# EAGLE design p2c14_001 (EAGLE 6.5.0)
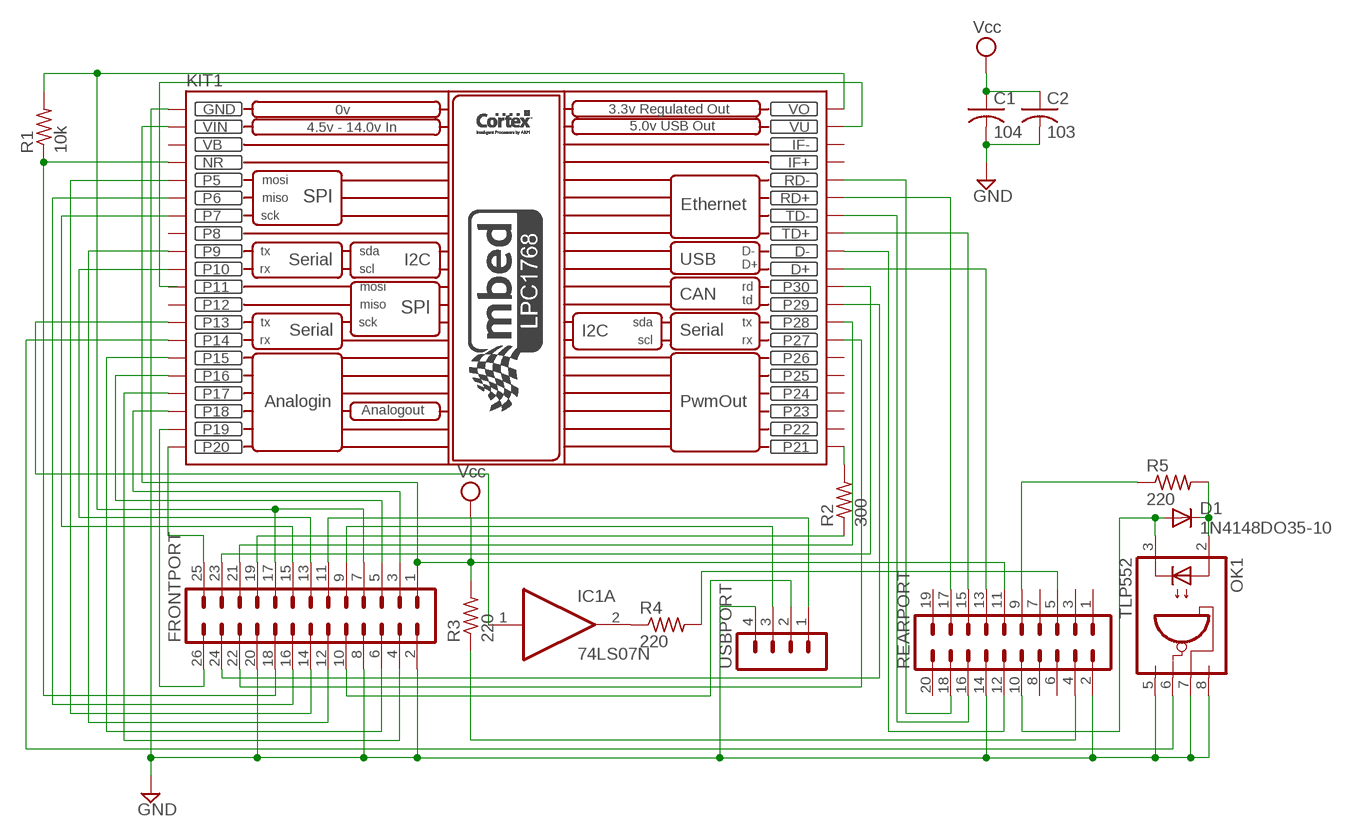
[diagram p0: schematic, sheet 1]

## Parts
C1  104  C-US025-025X050  [C025-025X050]
C2  103  C-US050-075X075  [C050-075X075]
D1  1N4148DO35-10  [DO35-10]
FRONTPORT  ML26L  [ML26L]
IC1  74LS07N  [DIL14]
KIT1  MBED_NXP_LPC1768  [MBED-KIT]
OK1  TLP552  6N137  [DIL08]
R1  10k  R-US_0204/7  [0204/7]
R2  300  R-US_0204/7  [0204/7]
R3  220  R-US_0204/7  [0204/7]
R4  220  R-US_0204/7  [0204/7]
R5  220  R-US_0204/7  [0204/7]
REARPORT  ML20L  [ML20L]
USBPORT  MA04-1  [MA04-1]

## Nets
GND: C1.2 C2.2 FRONTPORT.2 FRONTPORT.8 FRONTPORT.20 KIT1.GND OK1.5(GND) OK1.7(VE) OK1.8(VCC) REARPORT.2 REARPORT.14 USBPORT.4
N$1: R3.1 REARPORT.4
N$2: IC1.2(A:O) R4.1
N$3: D1.C OK1.2(A) R5.2
N$4: R5.1 REARPORT.9
N$5: KIT1.P$14(P14) OK1.6(VO)
N$6: KIT1.D- REARPORT.12
N$7: D1.A OK1.3(C) REARPORT.10
N$8: KIT1.D+ REARPORT.13
N$9: FRONTPORT.18 KIT1.NR R1.1
N$10: FRONTPORT.12 KIT1.P$9(P9)
N$11: FRONTPORT.11 USBPORT.1
N$12: FRONTPORT.3 KIT1.P$18(P18)
N$13: FRONTPORT.4 KIT1.P$17(P17)
N$14: FRONTPORT.5 KIT1.P$16(P16)
N$15: FRONTPORT.6 KIT1.P$15(P15)
N$16: KIT1.P$21(P21) R2.2
N$17: KIT1.TD+ REARPORT.15
N$18: FRONTPORT.13 KIT1.P$10(P10)
N$19: FRONTPORT.14 KIT1.P$5(P5)
N$20: FRONTPORT.15 KIT1.P$7(P7)
N$21: FRONTPORT.16 KIT1.P$6(P6)
N$22: FRONTPORT.19 R2.1
N$23: FRONTPORT.21 KIT1.P$28(P28)
N$24: FRONTPORT.22 KIT1.P$27(P27)
N$26: FRONTPORT.23 KIT1.P$30(P30)
N$27: FRONTPORT.24 KIT1.P$29(P29)
N$28: FRONTPORT.25 KIT1.P$20(P20)
N$29: FRONTPORT.26 KIT1.P$19(P19)
N$30: IC1.1(A:I) KIT1.P$13(P13)
N$31: R4.2 REARPORT.5
N$32: KIT1.TD- REARPORT.16
N$33: KIT1.RD+ REARPORT.17
N$34: KIT1.RD- REARPORT.18
N$35: KIT1.VU
N$36: FRONTPORT.7 FRONTPORT.17 KIT1.VOUT(VO) R1.2
N$39: FRONTPORT.10 USBPORT.2
N$40: FRONTPORT.9 USBPORT.3
VCC: C1.1 C2.1 FRONTPORT.1 KIT1.VIN R3.2 REARPORT.11 ; supply symbol labelled Vcc
Unconnected: IC1.3(B:I) IC1.4(B:O) IC1.5(C:I) IC1.6(C:O) IC1.8(D:O) IC1.9(D:I) IC1.10(E:O) IC1.11(E:I) IC1.12(F:O) IC1.13(F:I) KIT1.IF+ KIT1.IF- KIT1.P$8(P8) KIT1.P$11(P11) KIT1.P$12(P12) KIT1.P$22(P22) KIT1.P$23(P23) KIT1.P$24(P24) KIT1.P$25(P25) KIT1.P$26(P26) REARPORT.1 REARPORT.3 REARPORT.6 REARPORT.7 REARPORT.8 REARPORT.19 REARPORT.20

## Power pins joined to a net without a drawn wire
GND: IC1.7(P:GND)
VB: KIT1.VB
VCC: IC1.14(P:VCC)

## Library data of the parts
C1 C2 = rcl:C-US: CAPACITOR, American symbol
D1 = diode:1N4148: DIODE high speed (Philips)
FRONTPORT = con-ml:ML26L: HARTING; OC_FARNELL: unknown; OC_NEWARK: unknown
IC1 = 74xx-us:74*07: Hex BUFFER, open collector high-voltage output
KIT1 = MBED_v2.1:MBED_NXP_LPC1768: Mbed LPC1768 - ARM CORTEX v2.1 * Schematic symbol is now placed in eagles's default raster. *The pads diameter are suitable for routing between mbed pins * mbed pads are 0.8 mm drill diameter. --------------------------------------------- Created by: Mohamed Yousry *Alexandria, Egypt *Email: mohamed.yousry@ieeegoldegypt.org
OK1 = optocoupler:6N137: MOTOROLA OPTO COUPLER; MPN: 6N137; OC_FARNELL: 1328376; OC_NEWARK: 52M1895
R1-R5 = resistor:R-US_: RESISTOR, American symbol
REARPORT = con-ml:ML20L: HARTING; OC_FARNELL: unknown; OC_NEWARK: unknown
USBPORT = con-lstb:MA04-1: PIN HEADER; OC_FARNELL: unknown; OC_NEWARK: unknown

## Board
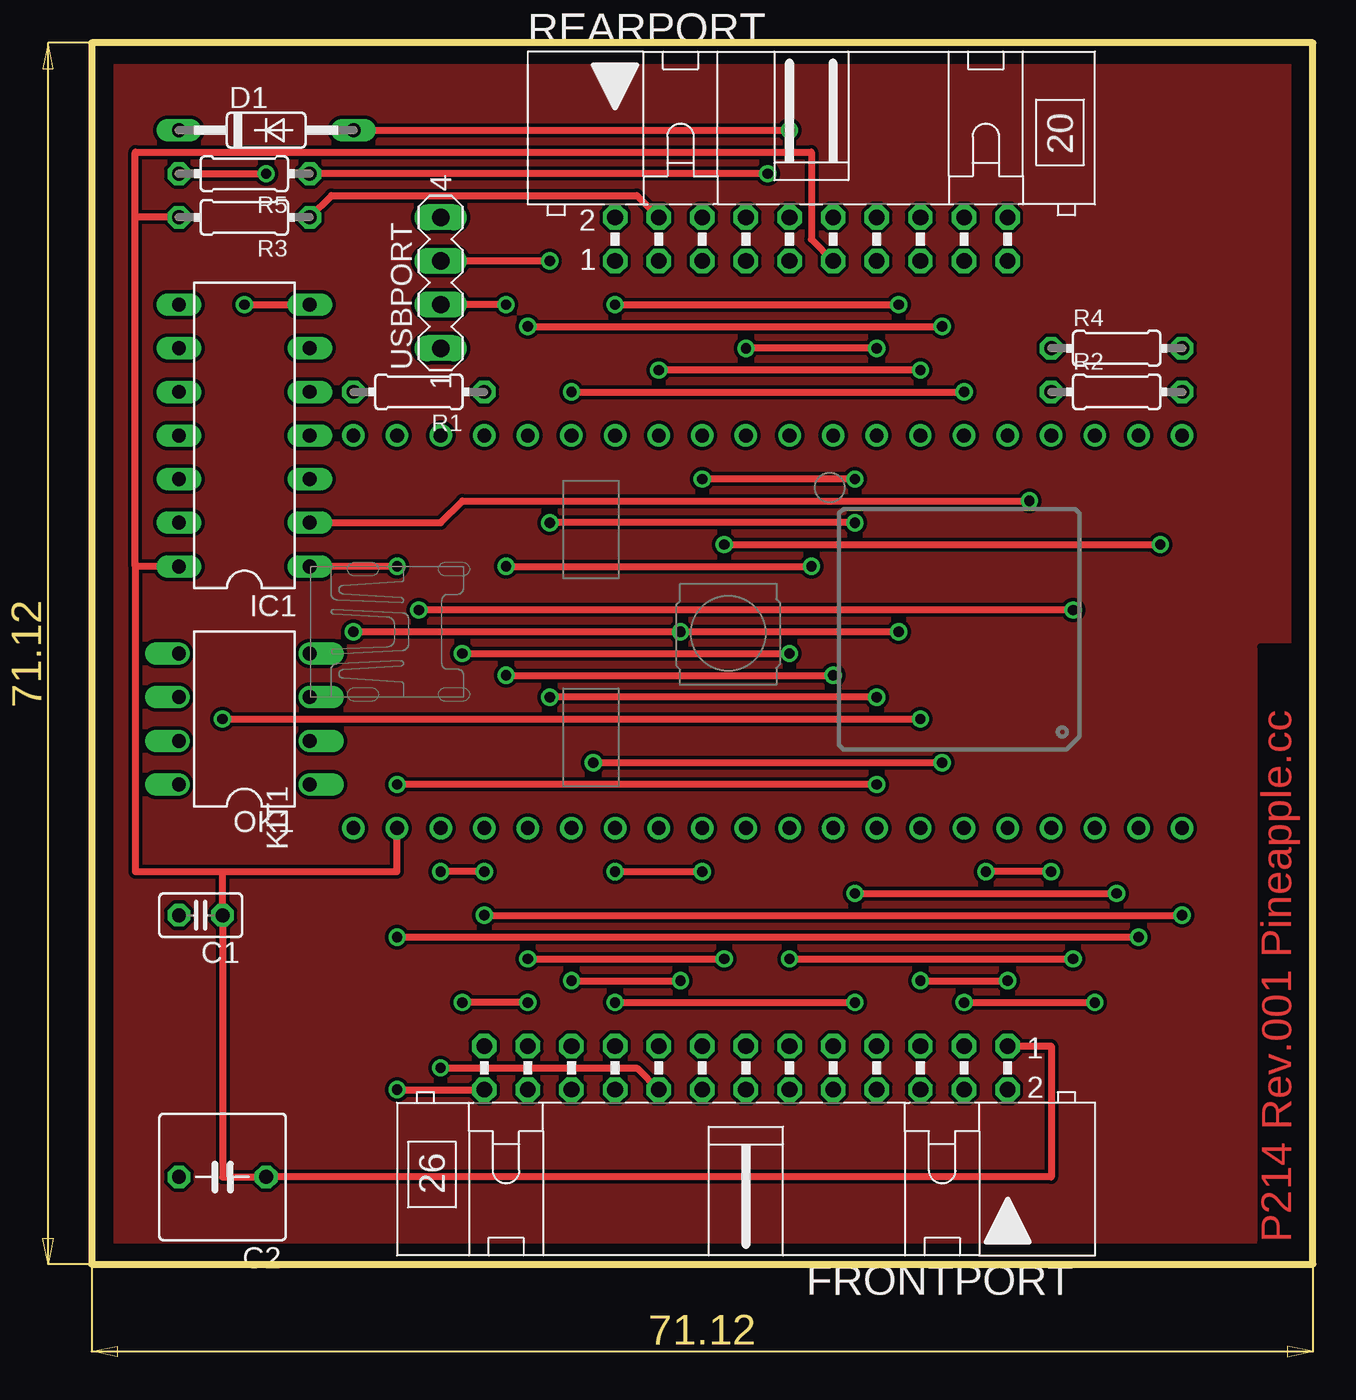
[diagram p1: board, top side]
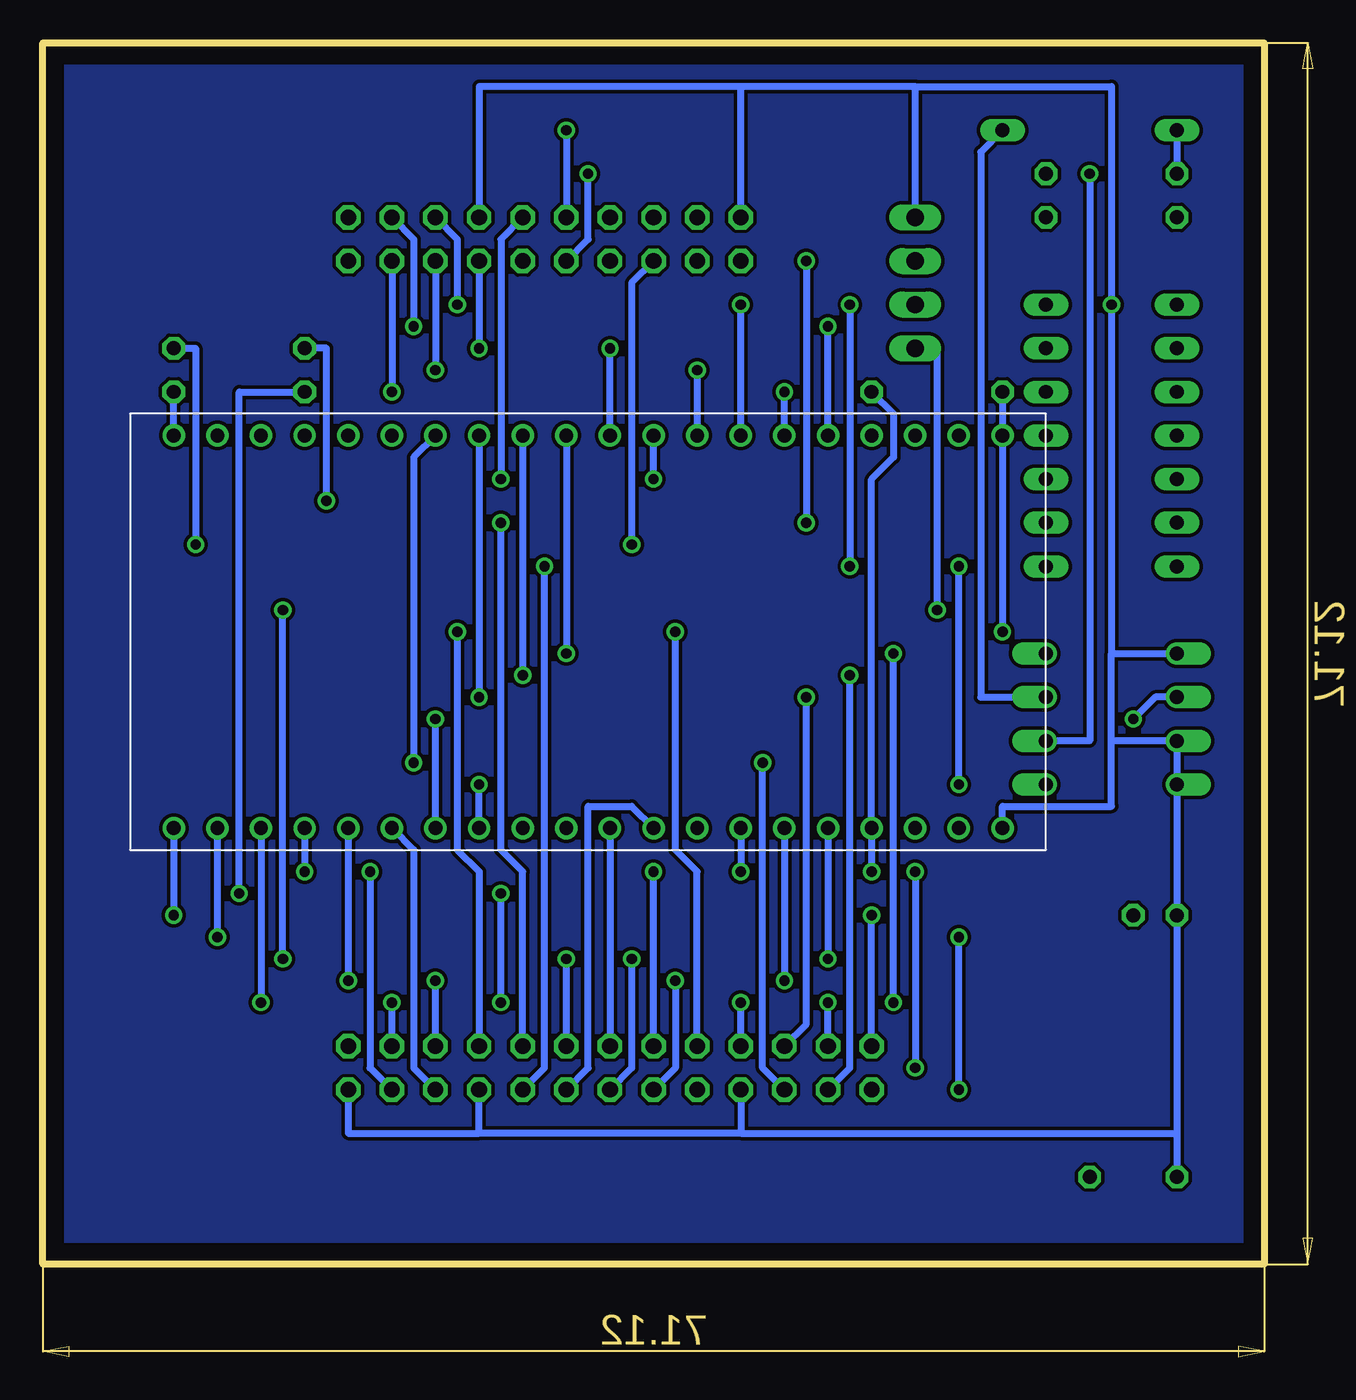
[diagram p2: board, bottom side, seen from below]

Size 71.12 x 71.12 mm. Coordinates in mm from the lower left corner, seen from the top.
Outline: 0,0 71.12,0 71.12,71.12 0,71.12 0,0
Copper layers (1*16): Top 0.035mm / dielectric 1.5mm / Bottom 0.035mm
Design rules "default": minimum track width 10mil, minimum drill 24mil, track to track 8mil, track to pad 8mil, pad to pad 8mil, via to via 8mil, smd to smd 8mil, copper to edge 40mil, drill to drill 8mil, minimum pad ring 10mil, minimum via ring 8mil, stop-mask expansion 4mil, vias tented up to drill 0mil, thermal gap 10mil

### Footprints (pad centres in the part's own frame; a part is rotated, then mirrored left to right if it is on the bottom)
C025-025X050 = drill 0.813 octagon: 1 -1.27,0; 2 1.27,0
C050-075X075 = drill 0.813 octagon: 1 -2.54,0; 2 2.54,0
DO35-10 = drill 0.813 long: A 5.08,0; C -5.08,0
ML26L = drill 0.914 octagon: 1 -15.24,-1.27; 2 -15.24,1.27; 3 -12.7,-1.27; 4 -12.7,1.27; 5 -10.16,-1.27; 6 -10.16,1.27; 7 -7.62,-1.27; 8 -7.62,1.27; 9 -5.08,-1.27; 10 -5.08,1.27; 11 -2.54,-1.27; 12 -2.54,1.27; 13 0,-1.27; 14 0,1.27; 15 2.54,-1.27; 16 2.54,1.27; 17 5.08,-1.27; 18 5.08,1.27; 19 7.62,-1.27; 20 7.62,1.27; 21 10.16,-1.27; 22 10.16,1.27; 23 12.7,-1.27; 24 12.7,1.27; 25 15.24,-1.27; 26 15.24,1.27
DIL14 = drill 0.813 long: 1 -7.62,-3.81; 2 -5.08,-3.81; 3 -2.54,-3.81; 4 0,-3.81; 5 2.54,-3.81; 6 5.08,-3.81; 7 7.62,-3.81; 8 7.62,3.81; 9 5.08,3.81; 10 2.54,3.81; 11 0,3.81; 12 -2.54,3.81; 13 -5.08,3.81; 14 -7.62,3.81
MBED-KIT = drill 0.8: D+ 11.43,1.27; D- 11.43,3.81; GND -11.43,24.13; IF+ 11.43,16.51; IF- 11.43,19.05; NR -11.43,16.51; P$5 -11.43,13.97; P$6 -11.43,11.43; P$7 -11.43,8.89; P$8 -11.43,6.35; P$9 -11.43,3.81; P$10 -11.43,1.27; P$11 -11.43,-1.27; P$12 -11.43,-3.81; P$13 -11.43,-6.35; P$14 -11.43,-8.89; P$15 -11.43,-11.43; P$16 -11.43,-13.97; P$17 -11.43,-16.51; P$18 -11.43,-19.05; P$19 -11.43,-21.59; P$20 -11.43,-24.13; P$21 11.43,-24.13; P$22 11.43,-21.59; P$23 11.43,-19.05; P$24 11.43,-16.51; P$25 11.43,-13.97; P$26 11.43,-11.43; P$27 11.43,-8.89; P$28 11.43,-6.35; P$29 11.43,-3.81; P$30 11.43,-1.27; RD+ 11.43,11.43; RD- 11.43,13.97; TD+ 11.43,6.35; TD- 11.43,8.89; VB -11.43,19.05; VIN -11.43,21.59; VOUT 11.43,24.13; VU 11.43,21.59
DIL08 = drill 0.813 offset: 1 -3.81,-3.81; 2 -1.27,-3.81; 3 1.27,-3.81; 4 3.81,-3.81; 5 3.81,3.81; 6 1.27,3.81; 7 -1.27,3.81; 8 -3.81,3.81
0204/7 = drill 0.813 octagon: 1 -3.81,0; 2 3.81,0
ML20L = drill 0.914 octagon: 1 -11.43,-1.27; 2 -11.43,1.27; 3 -8.89,-1.27; 4 -8.89,1.27; 5 -6.35,-1.27; 6 -6.35,1.27; 7 -3.81,-1.27; 8 -3.81,1.27; 9 -1.27,-1.27; 10 -1.27,1.27; 11 1.27,-1.27; 12 1.27,1.27; 13 3.81,-1.27; 14 3.81,1.27; 15 6.35,-1.27; 16 6.35,1.27; 17 8.89,-1.27; 18 8.89,1.27; 19 11.43,-1.27; 20 11.43,1.27
MA04-1 = drill 1.016 long: 1 -3.81,0; 2 -1.27,0; 3 1.27,0; 4 3.81,0

### Placement (x,y rotation side)
C1  6.35,20.32 180 top
C2  7.62,5.08 180 top
D1  10.16,66.04 0 top
FRONTPORT  38.1,11.43 180 top
IC1  8.89,48.26 90 top
KIT1  39.37,36.83 90 top
OK1  8.89,31.75 90 top
R1  19.05,50.8 180 top
R2  59.69,50.8 0 top
R3  8.89,60.96 180 top
R4  59.69,53.34 0 top
R5  8.89,63.5 180 top
REARPORT  41.91,59.69 0 top
USBPORT  20.32,57.15 90 top

### Tracks (layer width: path | path; a pad name or v marks a point on that pad's centre or on a via)
GND  (via drill 0.6)
  Top 0.406: v8.89,55.88 IC1.7
  Bottom 0.406: 30.48,7.62 45.72,7.62 | 45.72,7.62 FRONTPORT.8 | FRONTPORT.2 53.34,7.62 45.72,7.62 | FRONTPORT.20 30.48,7.62 | 30.48,7.62 5.08,7.62 | 5.08,7.62 C2.2 | 5.08,7.62 C1.2 OK1.8 OK1.7 8.89,30.48 | 8.89,30.48 8.89,35.56 | 8.89,35.56 OK1.5 | 8.89,35.56 v8.89,55.88 8.89,68.58 20.32,68.58 | 8.89,30.48 8.89,26.67 15.24,26.67 KIT1.GND | 20.32,68.58 30.48,68.58 | REARPORT.2 30.48,68.58 | 30.48,68.58 45.72,68.58 REARPORT.14 | USBPORT.4 20.32,68.58
N$1
  Top 0.406: R3.1 13.97,62.23 31.75,62.23 REARPORT.4
N$2  (via drill 0.6)
  Top 0.406: IC1.2 20.32,43.18 21.59,44.45 v54.61,44.45
  Bottom 0.406: v54.61,44.45 54.61,53.34 R4.1
N$3  (via drill 0.6)
  Top 0.406: R5.2 v10.16,63.5
  Bottom 0.406: v10.16,63.5 10.16,30.48 OK1.2 | D1.C R5.2
N$4  (via drill 0.6)
  Top 0.406: v39.37,63.5 R5.1
  Bottom 0.406: REARPORT.9 39.37,59.69 v39.37,63.5
N$5  (via drill 0.6)
  Top 0.406: v7.62,31.75 v48.26,31.75
  Bottom 0.406: OK1.6 6.35,33.02 v7.62,31.75 | KIT1.P$14 v48.26,31.75
N$6  (via drill 0.6)
  Top 0.406: v44.45,45.72 v35.56,45.72
  Bottom 0.406: REARPORT.12 44.45,59.69 v44.45,45.72 | v35.56,45.72 KIT1.D-
N$7  (via drill 0.6)
  Top 0.406: D1.A v40.64,66.04
  Bottom 0.406: v40.64,66.04 REARPORT.10 | D1.A 16.51,64.77 16.51,33.02 OK1.3
N$8  (via drill 0.6)
  Top 0.406: v45.72,53.34 v38.1,53.34
  Bottom 0.406: REARPORT.13 v45.72,53.34 | KIT1.D+ v38.1,53.34
N$9  (via drill 0.6)
  Top 0.406: v22.86,22.86 v20.32,22.86 | v20.32,11.43 31.75,11.43 FRONTPORT.18
  Bottom 0.406: R1.1 21.59,49.53 21.59,46.99 22.86,45.72 KIT1.NR v22.86,22.86 | v20.32,22.86 v20.32,11.43
N$10
  Bottom 0.406: FRONTPORT.12 39.37,11.43 39.37,26.67 36.83,26.67 KIT1.P$9
N$11  (via drill 0.6)
  Top 0.406: v57.15,38.1 v19.05,38.1 | v40.64,17.78 v57.15,17.78
  Bottom 0.406: USBPORT.1 19.05,53.34 v19.05,38.1 | FRONTPORT.11 v40.64,17.78 | v57.15,17.78 v57.15,38.1
N$12  (via drill 0.6)
  Top 0.406: v50.8,15.24 v58.42,15.24
  Bottom 0.406: KIT1.P$18 v58.42,15.24 | FRONTPORT.3 v50.8,15.24
N$13  (via drill 0.6)
  Top 0.406: v55.88,22.86 v52.07,22.86
  Bottom 0.406: KIT1.P$17 v55.88,22.86 | v52.07,22.86 52.07,11.43 FRONTPORT.4
N$14  (via drill 0.6)
  Top 0.406: v48.26,16.51 v53.34,16.51
  Bottom 0.406: KIT1.P$16 v53.34,16.51 | FRONTPORT.5 v48.26,16.51
N$15
  Bottom 0.406: KIT1.P$15 49.53,24.13 49.53,11.43 FRONTPORT.6
N$16
  Bottom 0.406: KIT1.P$21 R2.2
N$17  (via drill 0.6)
  Top 0.406: v48.26,52.07 v33.02,52.07
  Bottom 0.406: REARPORT.15 v48.26,52.07 | v33.02,52.07 KIT1.TD+
N$18
  Bottom 0.406: KIT1.P$10 FRONTPORT.13
N$19  (via drill 0.6)
  Top 0.406: v25.4,17.78 v36.83,17.78
  Bottom 0.406: v36.83,17.78 36.83,11.43 FRONTPORT.14 | KIT1.P$5 v25.4,17.78
N$20  (via drill 0.6)
  Top 0.406: v30.48,22.86 v35.56,22.86
  Bottom 0.406: KIT1.P$7 v30.48,22.86 | FRONTPORT.15 v35.56,22.86
N$21  (via drill 0.6)
  Top 0.406: v27.94,16.51 v34.29,16.51
  Bottom 0.406: KIT1.P$6 v27.94,16.51 | v34.29,16.51 34.29,11.43 FRONTPORT.16
N$22  (via drill 0.6)
  Top 0.406: v30.48,15.24 v44.45,15.24 | v44.45,21.59 v59.69,21.59
  Bottom 0.406: FRONTPORT.19 v30.48,15.24 | v44.45,15.24 v44.45,21.59 | v59.69,21.59 59.69,50.8 R2.1
N$23  (via drill 0.6)
  Top 0.406: v45.72,33.02 v26.67,33.02
  Bottom 0.406: FRONTPORT.21 26.67,13.97 v26.67,33.02 | KIT1.P$28 v45.72,33.02
N$24  (via drill 0.6)
  Top 0.406: v29.21,29.21 v49.53,29.21
  Bottom 0.406: KIT1.P$27 49.53,46.99 v49.53,29.21 | FRONTPORT.22 29.21,11.43 v29.21,29.21
N$25
  pour Top: 1.27,1.27 69.85,1.27 69.85,69.85 1.27,69.85
N$26  (via drill 0.6)
  Top 0.406: v25.4,15.24 v21.59,15.24 | v21.59,35.56 v40.64,35.56
  Bottom 0.406: FRONTPORT.23 v25.4,15.24 | v21.59,15.24 v21.59,35.56 | KIT1.P$30 v40.64,35.56
N$27  (via drill 0.6)
  Top 0.406: v24.13,34.29 v43.18,34.29
  Bottom 0.406: KIT1.P$29 v43.18,34.29 | FRONTPORT.24 24.13,11.43 v24.13,34.29
N$28  (via drill 0.6)
  Top 0.406: v22.86,20.32 v63.5,20.32
  Bottom 0.406: FRONTPORT.25 v22.86,20.32 | KIT1.P$20 v63.5,20.32
N$29  (via drill 0.6)
  Top 0.406: v17.78,19.05 v60.96,19.05 | v17.78,10.16 FRONTPORT.26
  Bottom 0.406: v17.78,10.16 v17.78,19.05 | KIT1.P$19 v60.96,19.05
N$30  (via drill 0.6)
  Top 0.406: v45.72,27.94 v17.78,27.94 | v17.78,40.64 IC1.1
  Bottom 0.406: KIT1.P$13 v45.72,27.94 | v17.78,27.94 v17.78,40.64
N$31  (via drill 0.6)
  Top 0.406: v36.83,41.91 v62.23,41.91
  Bottom 0.406: REARPORT.5 36.83,57.15 v36.83,41.91 | R4.2 62.23,53.34 v62.23,41.91
N$32  (via drill 0.6)
  Top 0.406: v30.48,55.88 v46.99,55.88
  Bottom 0.406: KIT1.TD- v30.48,55.88 | REARPORT.16 46.99,59.69 v46.99,55.88
N$33  (via drill 0.6)
  Top 0.406: v27.94,50.8 v50.8,50.8
  Bottom 0.406: KIT1.RD+ v27.94,50.8 | REARPORT.17 v50.8,50.8
N$34  (via drill 0.6)
  Top 0.406: v25.4,54.61 v49.53,54.61
  Bottom 0.406: KIT1.RD- v25.4,54.61 | REARPORT.18 49.53,59.69 v49.53,54.61
N$36  (via drill 0.6)
  Top 0.406: v15.24,36.83 v34.29,36.83 v46.99,36.83
  Bottom 0.406: R1.2 KIT1.VOUT v15.24,36.83 | FRONTPORT.17 33.02,22.86 34.29,24.13 v34.29,36.83 | v46.99,36.83 46.99,24.13 45.72,22.86 FRONTPORT.7
N$38
  pour Bottom: 1.27,69.85 69.85,69.85 69.85,1.27 1.27,1.27
N$39  (via drill 0.6)
  Top 0.406: v24.13,40.64 v41.91,40.64 | v24.13,55.88 USBPORT.2
  Bottom 0.406: FRONTPORT.10 41.91,11.43 v41.91,40.64 | v24.13,55.88 v24.13,40.64
N$40  (via drill 0.6)
  Top 0.406: v44.45,43.18 v26.67,43.18 | v26.67,58.42 USBPORT.3
  Bottom 0.406: FRONTPORT.9 43.18,22.86 44.45,24.13 v44.45,43.18 | v26.67,58.42 v26.67,43.18
VCC
  Top 0.406: 2.54,40.64 2.54,60.96 | IC1.14 2.54,40.64 | 2.54,40.64 2.54,22.86 7.62,22.86 | 7.62,22.86 17.78,22.86 KIT1.VIN | 7.62,22.86 C1.1 7.62,5.08 C2.1 55.88,5.08 55.88,12.7 FRONTPORT.1 | R3.2 2.54,60.96 | 2.54,60.96 2.54,64.77 41.91,64.77 41.91,59.69 REARPORT.11

### Text on the board
Top: P214 Rev.001 Pineapple.cc